# Altium schematic sheet BUF_input.SchDoc
size A4; SheetNumber: 2; SheetTotal: 6
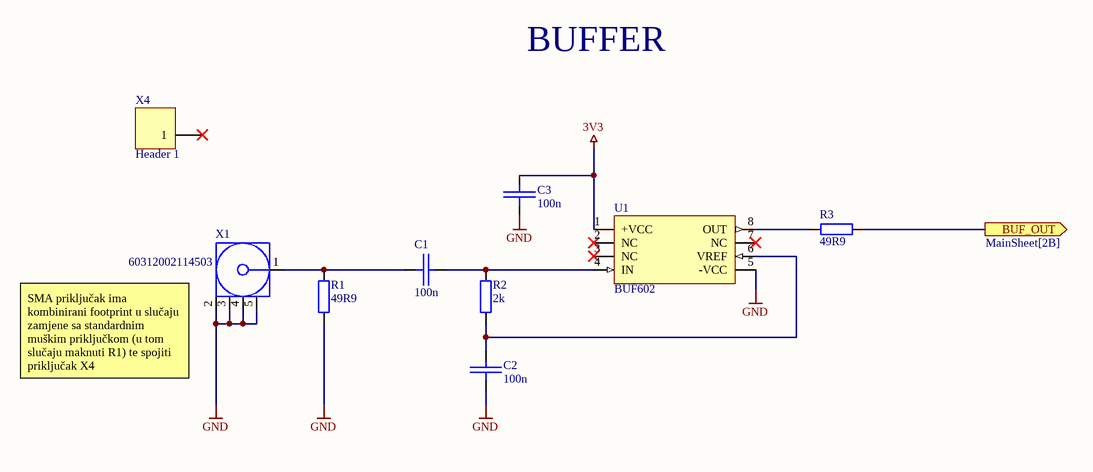
[diagram p0: BUF_input.SchDoc]

## Parts
C1  100n  [0805]
C2  100n  [0805]
C3  100n  [0805]
R1  49R9  [0805]
R2  2k  [0805]
R3  49R9  [0805]
U1  BUF602  [SOIC-8]
X1  60312002114503  [SMA]  (no BOM)
X4  Header 1  [HDR1X2]

## Ports
BUF_OUT (out, see MainSheet[2B])

## Nets
3V3: C3.2 U1.1(+VCC)
GND: C2.1 C3.1 R1.1 U1.5(-VCC) X1.2 X1.3 X1.4 X1.5
BUF_OUT: R3.2 ; port BUF_OUT
NetC1_1: C1.1 R1.2 X1.1
NetC1_2: C1.2 R2.2 U1.4(IN)
NetC2_2: C2.2 R2.1 U1.6(VREF)
NetR3_1: R3.1 U1.8(OUT)

Not connected (* = marked no-connect by the designer): U1 2(NC)* 3(NC)* 7(NC)*; X4 1*

## Notes on the sheet
- BUFFER
- (near X1) SMA priključak ima kombinirani footprint u slučaju zamjene sa standardnim muškim priključkom (u tom slučaju maknuti R1) te spojiti priključak X4

## Library data of the parts
C1-C3 = MCJCU21GBB7104KTPA01: Kondenzator, X7R, 10%, 50VDC; Manufacturer: TDK; Manufacturer Part Number: C2012X7R1H104K125AE; Capacitance: 100nF; Value: 100nF; Supplier 1: Mouser; Case/Package: 0805; ComponentLink1Description: https://datasheet.ciiva.com/29534/mlcc-commercial-soft-en-29534235.pdf?src-supplier=Digi-Key; Supplier Part Number 1: 963-MCJCU21GBB7104KT; Category: Ceramic Capacitors; Supplier 2: Mouser; Supplier Part Number 2: 810-C2012X7R1H104KAE; Kučište: 0805
R1 R3 = AC0805FR-0749R9L: Otpornik, ±100ppm/C, 125mW; Manufacturer: Yageo; Value: 49,9; Supplier 1: Mouser; Manufacturer Part Number: AC0805FR-0749R9L; Category: Chip SMD Resistors; Case/Package: 0805; ComponentLink1Description: http://www.yageo.com/NewPortal/yageodocoutput?fileName=/pdf/R-Chip/PYu-AC_51_RoHS_L_6.pdf&src-supplier=Digi-Key; Supplier Part Number 1: 603-AC0805FR-0749R9L; Kučište: 0805
R2 = RC0805FR-102KL: Otpornik, 1%, 125mW; Manufacturer: Yageo; Supplier 1: Mouser; Supplier Part Number 1: 603-RC0805FR-102KL; Kučište: 0805; Manufacturer Part Number: RC0805FR-102KL; Category: Resistors; Case/Package: 0805
U1 = BUF602: Integrirani Buffer; Manufacturer: Texas Instruments; Manufacturer Part Number: BUF602ID; Supplier 1: Mouser; Supplier Part Number 1: 595-BUF602ID; Category: Operational Amplifiers; Case/Package: SOIC-8
X1 = 60312002114503: SMA priključak; Manufacturer: Wurth Electronics; Supplier 1: Mouser; Manufacturer Part Number: 60312002114503; Supplier Part Number 1: 710-60312002114503; Category: SMA Connector
X4 = Header 2: Header, 1-Pin; LatestRevisionDate: 17-Jul-2002; LatestRevisionNote: Re-released for DXP Platform.; Publisher: Altium Limited